# EAGLE design FadeCandyS (EAGLE 9.1.3)
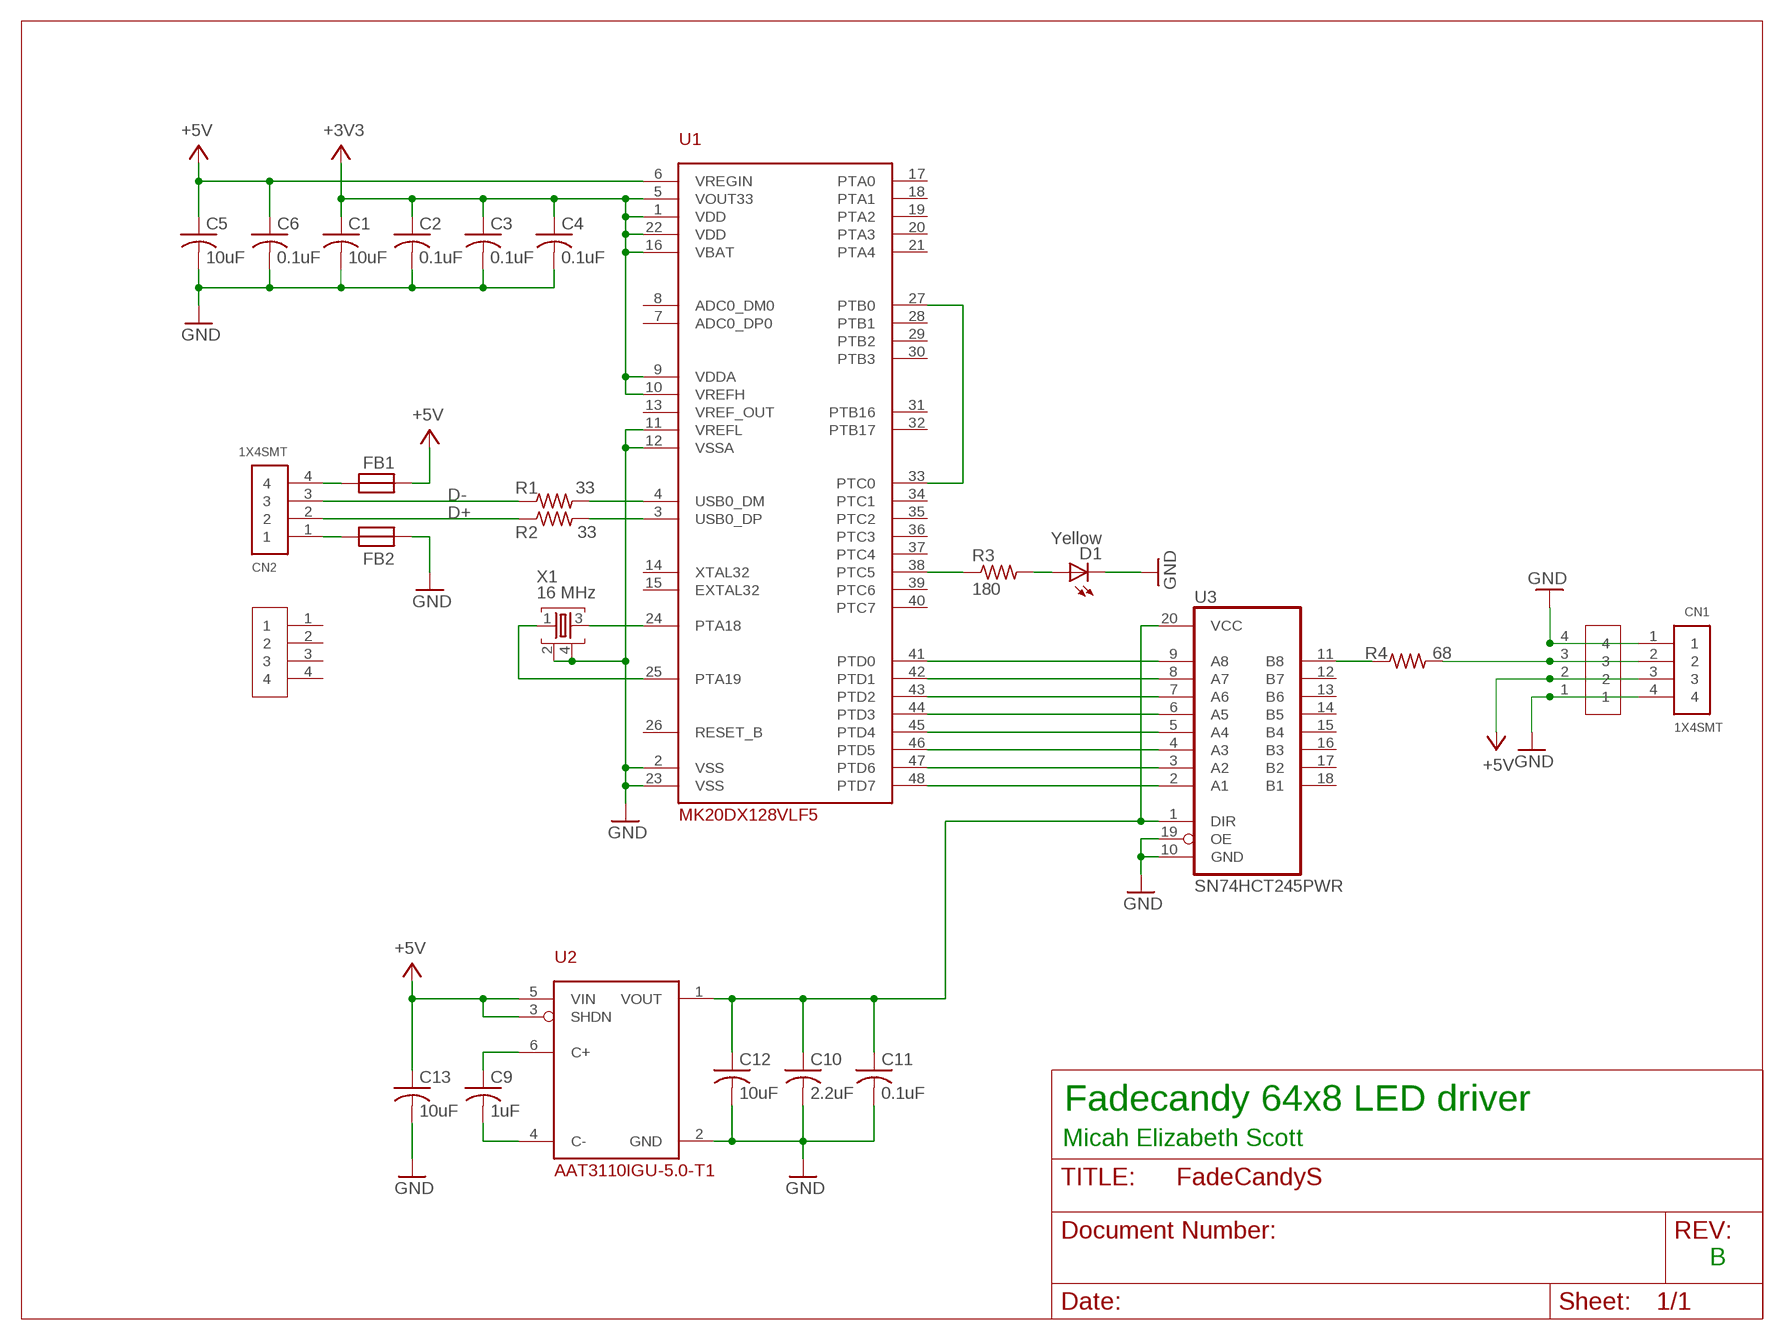
[diagram p0: schematic, sheet 1]

## Parts
1X4_HALFVIA  1X4_HALFVIA  [1X4_HALFVIA]
C1  10uF  C-US0805/NO-OUTLINE  [0805]
C2  0.1uF  C-US0805/NO-OUTLINE  [0805]
C3  0.1uF  C-US0805/NO-OUTLINE  [0805]
C4  0.1uF  C-US0805/NO-OUTLINE  [0805]
C5  10uF  C-US0805/NO-OUTLINE  [0805]
C6  0.1uF  C-US0805/NO-OUTLINE  [0805]
C9  1uF  C-US0805/NO-OUTLINE  [0805]
C10  2.2uF  C-US0805/NO-OUTLINE  [0805]
C11  0.1uF  C-US0805/NO-OUTLINE  [0805]
C12  10uF  C-US0805/NO-OUTLINE  [0805]
C13  10uF  C-US0805/NO-OUTLINE  [0805]
CN1  1X4SMT  [1X4-SMT]
CN2  1X4SMT  [1X4-SMT]
D1  Yellow  LEDCHIP-LED0805  [CHIP-LED0805]
FB1  FB0805/NO-OUTLINE  [0805]
FB2  FB0805/NO-OUTLINE  [0805]
R1  33  R-US_0805/NO-OUTLINE  [0805]
R2  33  R-US_0805/NO-OUTLINE  [0805]
R3  180  R-US_0805/NO-OUTLINE  [0805]
R4  68  R-US_0805/NO-OUTLINE  [0805]
U1  MK20DX128VLF5  [LQFP48]
U2  AAT3110IGU-5.0-T1  AAT3110  [SOT23-6L]
U3  SN74HCT245PWR  74245PW  [TSSOP20]
U$1  1X4_HALFVIA  [1X4_HALFVIA]
X1  16 MHz  TSX-32250  [TSX-3225]

## Nets
+3V3: C1.1 C2.1 C3.1 C4.1 U1.1(VDD) U1.5(VOUT33) U1.9(VDDA) U1.10(VREFH) U1.16(VBAT) U1.22(VDD)
+5V: 1X4_HALFVIA.2 C5.1 C6.1 C13.1 CN1.3 FB1.2 U1.6(VREGIN) U2.3(SHDN) U2.5(VIN)
D+: CN2.2 R2.1
D-: CN2.3 R1.1
GND: 1X4_HALFVIA.1 1X4_HALFVIA.4 C1.2 C2.2 C3.2 C4.2 C5.2 C6.2 C10.2 C11.2 C12.2 C13.2 CN1.1 CN1.4 D1.C FB2.2 U1.2(VSS) U1.11(VREFL) U1.12(VSSA) U1.23(VSS) U2.2(GND) U3.10(GND) U3.19(OE) X1.2 X1.4
N$1: R3.1 U1.38(PTC5)
N$2: U1.24(PTA18) X1.3
N$3: D1.A R3.2
N$4: U1.25(PTA19) X1.1
N$5: CN2.4 FB1.1
N$6: U1.27(PTB0) U1.33(PTC0)
N$7: CN2.1 FB2.1
N$8: U1.41(PTD0) U3.9(A8)
N$9: 1X4_HALFVIA.3 CN1.2 R4.2
N$11: R1.2 U1.4(USB0_DM)
N$12: R2.2 U1.3(USB0_DP)
N$13: U1.42(PTD1) U3.8(A7)
N$14: U1.43(PTD2) U3.7(A6)
N$15: U1.44(PTD3) U3.6(A5)
N$16: U1.45(PTD4) U3.5(A4)
N$17: U1.46(PTD5) U3.4(A3)
N$18: U1.47(PTD6) U3.3(A2)
N$19: U1.48(PTD7) U3.2(A1)
N$20: R4.1 U3.11(B8)
N$21: C9.1 U2.6(C+)
N$22: C9.2 U2.4(C-)
N$27: C10.1 C11.1 C12.1 U2.1(VOUT) U3.1(DIR) U3.20(VCC)
Unconnected: U1.7(ADC0_DP0) U1.8(ADC0_DM0) U1.13(VREF_OUT) U1.14(XTAL32) U1.15(EXTAL32) U1.17(PTA0) U1.18(PTA1) U1.19(PTA2) U1.20(PTA3) U1.21(PTA4) U1.26(RESET_B) U1.28(PTB1) U1.29(PTB2) U1.30(PTB3) U1.31(PTB16) U1.32(PTB17) U1.34(PTC1) U1.35(PTC2) U1.36(PTC3) U1.37(PTC4) U1.39(PTC6) U1.40(PTC7) U3.12(B7) U3.13(B6) U3.14(B5) U3.15(B4) U3.16(B3) U3.17(B2) U3.18(B1) U$1.1 U$1.2 U$1.3 U$1.4

## Notes on the sheet
- Fadecandy 64x8 LED driver
- Micah Elizabeth Scott
- B

## Library data of the parts
1X4_HALFVIA U$1 = brian:1X4_HALFVIA
C1-C6 C9-C13 = scanlime:C-US: CAPACITOR, American symbol
CN1 CN2 = adafruit:1X4: 4-pin connector
D1 = adafruit:LED: LED OSRAM: - CHIPLED LG R971, LG N971, LY N971, LG Q971, LY Q971, LO R971, LY R971 LH N974, LH R974 LS Q976, LO Q976, LY Q976 LO Q996 - Hyper CHIPLED LW Q18S LB Q993, LB Q99A, LB R99A - SideLED LS A670, LO A670, LY A670, LG A670, LP A670 LB A673, LV A673, LT A673, LW A673 LH A674 LY A675 LS A676, LA A676, LO A676, LY A676, LW A676 LS A679, LY A679, LG A679 - Hyper Micro SIDELED® LS Y876, LA Y876, LO Y876, LY Y876 LT Y87S - SmartLED LW L88C, LW L88S LB L89C, LB L89S, LG L890 LS L89K, LO L89K, LY L89K LS L896, LA L896, LO L896, LY L896 - TOPLED LS T670, LO T670, LY T670, LG T670, LP T670 LSG T670, LSP T670, LSY T670, LOP T670, LYG T670 LG T671, LOG T671, LSG T671 LB T673, LV T673, LT T673, LW T673 LH T674 LS T676, LA T676, LO T676, LY T676, LB T676, LH T676, LSB T676, LW T676 LB T67C, LV T67C, LT T67C, LS T67K, LO T67K, LY T67K, LW E67C LS E67B, LA E67B, LO E67B, LY E67B, LB E67C, LV E67C, LT E67C LW T67C LS T679, LY T679, LG T679 LS T770, LO T770, LY T770, LG T770, LP T770 LB T773, LV T773, LT T773, LW T773 LH T774 LS E675, LA E675, LY E675, LS T675 LS T776, LA T776, LO T776, LY T776, LB T776 LHGB T686 LT T68C, LB T68C - Hyper Mini TOPLED® LB M676 - Mini TOPLED Santana® LG M470 LS M47K, LO M47K, LY M47K Source: http://www.osram.convergy.de/
FB1 FB2 = scanlime:FB
R1-R4 = scanlime:R-US_: RESISTOR, American symbol
U1 = scanlime:MK20DX128VLF5: ARM Cortex-M4 microcontroller with USB. Freescale K20 series 50 MHz 16 K RAM 128 K Flash Lower pincount equivalent to Teensy 3.0 2013 Price: $2.66 qty 100 Digi-Key: MK20DX128VLF50-ND <http://www.digikey.com/product-detail/en/MK20DX128VLF5/MK20DX128VLF50-ND/3507511>
U2 = scanlime:AAT3110: Switched capacitor boost converter
U3 = scanlime:74*245: Octal BUS TRANSCEIVER, 3-state
X1 = scanlime:TSX-3225: MHz RANGE CRYSTAL UNIT Source: Epson Toyocom

## Board
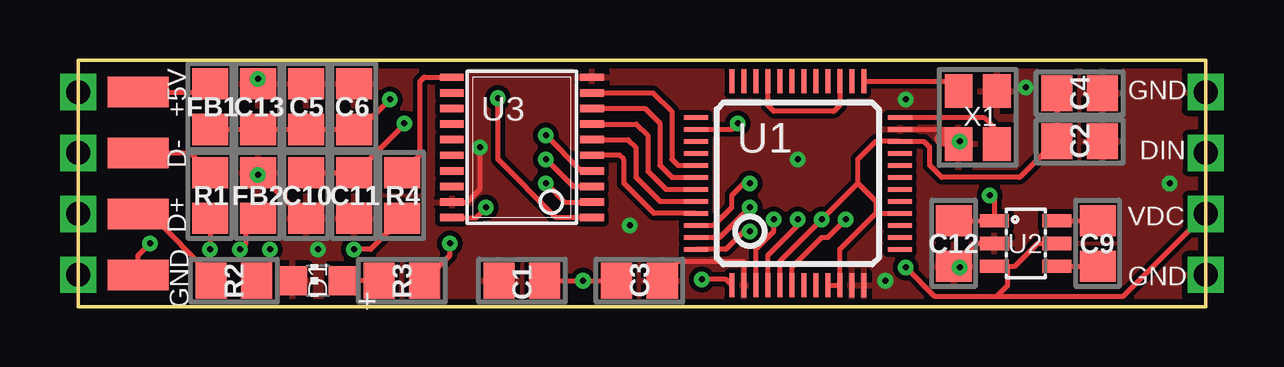
[diagram p1: board, top side]
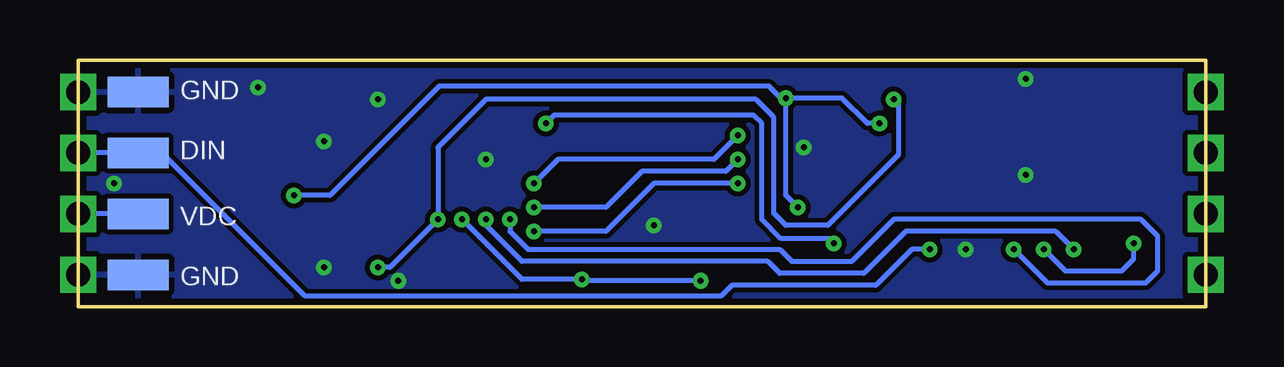
[diagram p2: board, bottom side, seen from below]

Size 47 x 10.29 mm. Coordinates in mm from the lower left corner, seen from the top.
Outline: 0,10.29 0,0 47,0 47,10.29 0,10.29
Copper layers (1*16): Top 0.035mm / dielectric 1.5mm / Bottom 0.035mm
Design rules "adafruit": minimum track width 8mil, minimum drill 15.5mil, track to track 8mil, track to pad 8mil, pad to pad 8mil, via to via 8mil, smd to smd 8mil, copper to edge 10mil, drill to drill 8mil, minimum pad ring 10mil, minimum via ring 8mil, stop-mask expansion 4mil, vias tented up to drill 20mil, thermal gap 10mil

### Footprints (pad centres in the part's own frame; a part is rotated, then mirrored left to right if it is on the bottom)
1X4_HALFVIA = drill 1 square: 1 -3.81,0; 2 -1.27,0; 3 1.27,0; 4 3.81,0
0805 = smd 1.3 x 1.5: 1 -0.95,0; 2 0.95,0
1X4-SMT = smd 1.27 x 2.54: 1 -3.81,0; 2 -1.27,0; 3 1.27,0; 4 3.81,0
CHIP-LED0805 = smd 1.2 x 1.2: A 0,-1.05; C 0,1.05
LQFP48 = smd 0.203 x 1: 1 -2.75,-4.25; 2 -2.25,-4.25; 3 -1.75,-4.25; 4 -1.25,-4.25; 5 -0.75,-4.25; 6 -0.25,-4.25; 7 0.25,-4.25; 8 0.75,-4.25; 9 1.25,-4.25; 10 1.75,-4.25; 11 2.25,-4.25; 12 2.75,-4.25; 25 2.75,4.25; 26 2.25,4.25; 27 1.75,4.25; 28 1.25,4.25; 29 0.75,4.25; 30 0.25,4.25; 31 -0.25,4.25; 32 -0.75,4.25; 33 -1.25,4.25; 34 -1.75,4.25; 35 -2.25,4.25; 36 -2.75,4.25 | smd 1 x 0.203: 13 4.25,-2.75; 14 4.25,-2.25; 15 4.25,-1.75; 16 4.25,-1.25; 17 4.25,-0.75; 18 4.25,-0.25; 19 4.25,0.25; 20 4.25,0.75; 21 4.25,1.25; 22 4.25,1.75; 23 4.25,2.25; 24 4.25,2.75; 37 -4.25,2.75; 38 -4.25,2.25; 39 -4.25,1.75; 40 -4.25,1.25; 41 -4.25,0.75; 42 -4.25,0.25; 43 -4.25,-0.25; 44 -4.25,-0.75; 45 -4.25,-1.25; 46 -4.25,-1.75; 47 -4.25,-2.25; 48 -4.25,-2.75
SOT23-6L = smd 0.55 x 1.2: 1 -0.95,-1.3; 2 0,-1.3; 3 0.95,-1.3; 4 0.95,1.3; 5 0,1.3; 6 -0.95,1.3
TSSOP20 = smd 0.305 x 0.991: 1 -2.925,-2.918; 2 -2.275,-2.918; 3 -1.625,-2.918; 4 -0.975,-2.918; 5 -0.325,-2.918; 6 0.325,-2.918; 7 0.975,-2.918; 8 1.625,-2.918; 9 2.275,-2.918; 10 2.925,-2.918; 11 2.925,2.918; 12 2.275,2.918; 13 1.625,2.918; 14 0.975,2.918; 15 0.325,2.918; 16 -0.325,2.918; 17 -0.975,2.918; 18 -1.625,2.918; 19 -2.275,2.918; 20 -2.925,2.918
TSX-3225 = smd 1.4 x 1.15: 1 -1.1,-0.8; 2 1.1,-0.8; 3 1.1,0.8; 4 -1.1,0.8

### Placement (x,y rotation side)
1X4_HALFVIA  47,5.14 90 top
C1  18.5,1.09 180 top
C2  41.75,6.89 0 top
C3  23.4,1.09 0 top
C4  41.75,8.89 0 top
C5  9.5,8.34 90 top
C6  11.5,8.34 90 top
C9  42.5,2.64 270 top
C10  9.5,4.64 270 top
C11  11.5,4.64 270 top
C12  36.5,2.64 270 top
C13  7.5,8.34 90 top
CN1  44.5,5.14 270 bottom
CN2  2.5,5.14 90 top
D1  10,1.09 90 top
FB1  5.5,8.34 270 top
FB2  7.5,4.64 90 top
R1  5.5,4.64 270 top
R2  6.5,1.09 0 top
R3  13.5,1.09 180 top
R4  13.5,4.64 270 top
U1  30,5.14 0 top
U2  39.5,2.64 270 top
U3  18.5,6.64 90 top
U$1  0,5.14 90 top
X1  37.5,7.89 270 top

### Tracks (layer width: path | path; a pad name or v marks a point on that pad's centre or on a via)
+3V3  (via drill 0.25)
  Top 0.203: C1.1 v21.05,1.09 C3.1 | U1.1 27,1.14 v26,1.14 | U1.9 U1.10 31.75,1.64 | 31.75,1.64 31.75,1.89 | U1.5 29.25,1.89 v31,3.64 32.5,5.14 | C4.1 C2.1 40.3,6.39 40.25,6.39 39.25,5.39 36,5.39 35.5,5.89 35.5,6.64 35.25,6.89 U1.22 33.25,6.89 32.5,6.14 32.5,5.14 | 31.75,1.64 31.75,2.39 33.25,3.89 | 33.25,3.89 U1.16 | 32.5,5.14 33.25,4.39 33.25,3.89
  Bottom 0.203: v21.05,1.09 25.95,1.09 v26,1.14 28.5,1.14 v31,3.64
+5V  (via drill 0.25)
  Top 0.203: FB1.2 C13.1 C5.1 C6.1 11.75,7.39 v13,8.64 | U1.6 29.75,1.64 31,2.89 31.25,2.89 v32,3.64 | v34.5,1.64 35.7,0.44 38.3,0.44 | 38.3,0.44 38.75,0.89 38.75,1.64 38.7,1.69 U2.3 39.05,1.69 39.75,2.39 40,2.64 U2.5 | 38.3,0.44 43.57,0.44 46.38,3.26 | 46.38,3.26 46.57,3.44 | 1X4_HALFVIA.2 46.38,3.26
  Bottom 0.203: v34.5,1.64 34,1.64 v32,3.64 32,6.64 30,8.64 18.75,8.64 18,7.89 18,3.89 17.5,3.39 15.75,3.39 12.8,6.34 12.8,8.44 v13,8.64 | CN1.3 1X4_HALFVIA.2
D+
  Top 0.203: R2.1 5.55,1.32 3,3.87 CN2.2
D-
  Top 0.203: CN2.3 4.68,6.41 R1.1
GND  (via drill 0.25)
  Top 0.203: FB2.2 9.4,3.69 C10.2 | U1.23 36.1,7.39 36.35,7.15 | C12.2 37.45,2.64 U2.2 | U1.2 27.75,1.89 24.95,1.89 | U3.19 16.23,4.37 16.75,4.89 v16.75,6.64
  Top 0.61: X1.2 36.49,7 36,7 36.15,7.15 36.35,7.15
  other vias: 23,3.39 30,6.14 10,2.39 39.5,9.14 34.5,8.64 36.75,6.89 36.75,1.64 33.65,1.09 45.5,5.14 7.5,5.5 7.5,9.5
  pour Top: 0,10.29 0,0 47,0 47,10.29
  pour Bottom: 0,10.29 0,0 47,0 47,10.29
N$1  (via drill 0.25)
  Top 0.203: 14.5,1.04 R3.1 15.5,2.14 v15.5,2.64 | U1.38 27.25,7.39 v27.5,7.64
  Bottom 0.203: v27.5,7.64 27.15,7.99 18.85,7.99 18.5,7.64 18.5,3.64 17.7,2.84 15.7,2.84 v15.5,2.64
N$2
  Top 0.203: U1.24 37.75,7.89 38.3,7.34 X1.3
N$3
  Top 0.203: R3.2 D1.A
N$4
  Top 0.203: U1.25 36.3,9.39 X1.1
N$5
  Top 0.203: 5.05,8.84 FB1.1 5.16,8.95 CN2.4
N$6
  Top 0.203: U1.27 31.75,8.39 31.5,8.14 29,8.14 28.75,8.39 U1.33
N$7  (via drill 0.25)
  Top 0.203: 2.81,1.33 CN2.1 2.5,2.14 v3,2.64 | v6.75,2.39 7,2.64 7,3.64 7.05,3.69 FB2.1
  Bottom 0.203: v6.75,2.39 5.86,1.5 3.5,1.5 3,2 v3,2.64
N$8
  Top 0.203: U3.9 23.98,8.92 24.75,8.14 24.75,6.14 25,5.89 U1.41
N$9  (via drill 0.25)
  Top 0.203: R4.2 12.2,2.39 v11.5,2.39
  Bottom 0.203: v11.5,2.39 12.25,2.39 13.75,0.89 19.75,0.89 20.2,0.44 37.53,0.44 43.12,6.03 43.37,6.28 43.5,6.41 CN1.2 1X4_HALFVIA.3
N$11  (via drill 0.25)
  Top 0.203: R1.2 v5.5,2.39 | U1.4 28.75,2.14 30,3.39 v30,3.64
  Bottom 0.203: v5.5,2.39 6.25,3.14 12.5,3.14 14.25,1.39 17.75,1.39 18.25,1.89 28.5,1.89 30,3.39 v30,3.64
N$12  (via drill 0.25)
  Top 0.203: R2.2 8,1.64 v8,2.39 | U1.3 28.25,2.39 29,3.14 v29,3.64
  Bottom 0.203: v29,3.64 29,3.14 28.25,2.39 17.75,2.39 17.25,1.89 14.75,1.89 13,3.64 2.7,3.64 2,2.94 2,1.5 2.5,1 6.61,1 v8,2.39
N$13
  Top 0.203: U3.8 23.62,8.27 24.25,7.64 24.25,5.89 24.75,5.39 U1.42
N$14
  Top 0.203: U3.7 23.27,7.62 23.75,7.14 23.75,5.64 24.5,4.89 U1.43
N$15
  Top 0.203: U3.6 22.93,6.97 23.25,6.64 23.25,5.39 24.25,4.39 U1.44
N$16
  Top 0.203: U1.45 24,3.89 22.75,5.14 22.75,6.14 22.57,6.32 U3.5
N$17  (via drill 0.25)
  Top 0.203: U3.4 20.98,5.67 v19.5,7.14 | U1.46 26.5,3.39 27.25,4.14 27.25,4.64 27.75,5.14 v28,5.14
  Bottom 0.203: v28,5.14 27,6.14 20.5,6.14 v19.5,7.14
N$18  (via drill 0.25)
  Top 0.203: U3.3 20.62,5.02 v19.5,6.14 | U1.47 26.75,2.89 v28,4.14
  Bottom 0.203: v19.5,6.14 20,5.64 23.5,5.64 25,4.14 v28,4.14
N$19  (via drill 0.25)
  Top 0.203: v19.5,5.14 20.27,4.37 U3.2 | v28,3.14 27.75,3.14 27,2.39 U1.48
  Bottom 0.203: v19.5,5.14 23,5.14 25,3.14 v28,3.14
N$20
  Top 0.203: 13.75,5.84 R4.1 14.25,6.34 14.25,9.39 14.43,9.57 U3.11
N$21
  Top 0.203: U2.6 C9.1
N$22
  Top 0.203: U2.4 C9.2
N$27  (via drill 0.25)
  Top 0.203: C10.1 C11.1 11.6,5.59 13.6,7.59 v13.6,7.64 | v38,4.64 38.2,4.44 U2.1 C12.1 | U3.1 19.93,3.72 17.5,6.14 v17.5,8.69 | U3.20 16.58,3.72 v17,4.14
  Bottom 0.203: v38,4.64 36.5,4.64 31.94,9.2 18.2,9.2 17.69,8.69 v17.5,8.69 | v17.5,8.69 15.15,8.69 14.1,7.64 v13.6,7.64 | v17,4.14 17.5,4.64 v17.5,8.69

### Text on the board
tPlace: GND | +5V | D- | DIN | D+ | VDC | GND | GND
bPlace: GND | DIN | VDC | GND
bStop: FadeCandy S | v1.0